# EAGLE design pi-hrf (EAGLE 7.5.0)
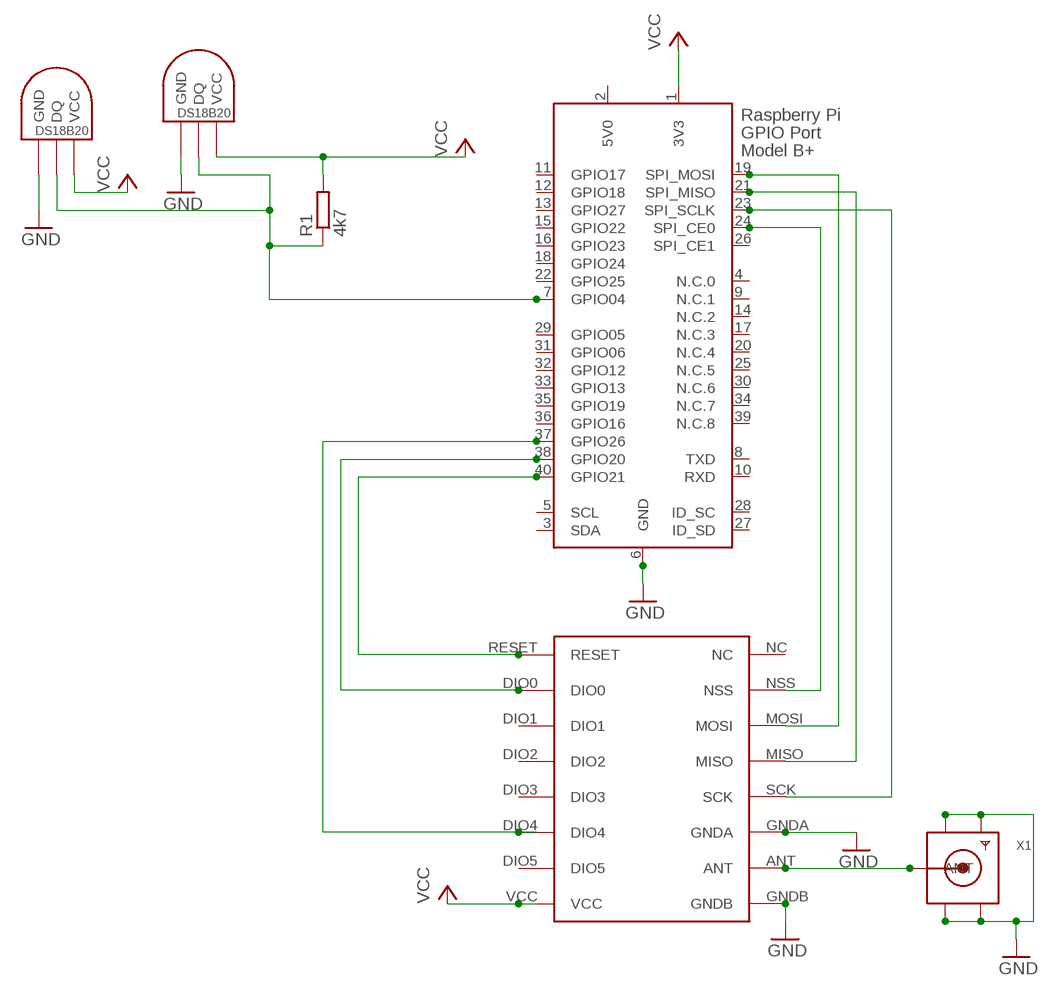
[diagram p0: schematic, sheet 1]

## Parts
R1  4k7  R-EU_0207/10  [0207/10]
U1  RFM69HW  [RFM]
U$2  DS1820TO92  [DS1820]
U$3  DS1820TO92  [DS1820]
X1  SMACONNECTOR_EDGE  [SMA_EDGELAUNCH]
X2  RASPI_BOARD_B+_E3P  [RASPI_BOARD_B+_EDGES_3DRILL_PAD]

## Nets
GND: U1.GNDA U1.GNDB U$2.GND U$3.GND X1.GND@1(GND4) X1.GND@2(GND3) X1.GND@3(GND2) X1.GND@4(GND1) X2.6(GND)
N$1: U1.NSS X2.24(SPI_CE0)
N$2: U1.SCK X2.23(SPI_SCLK)
N$3: U1.MOSI X2.19(SPI_MOSI)
N$5: R1.1 U$2.DQ U$3.DQ X2.7(GPIO04)
N$6: U1.ANT X1.P(ANT)
N$7: U1.RESET X2.40(GPIO21)
N$8: U1.DIO0 X2.38(GPIO20)
N$9: U1.DIO4 X2.37(GPIO26)
N$10: U1.MISO X2.21(SPI_MISO)
VCC: R1.2 U1.VCC U$2.VDD(VCC) U$3.VDD(VCC) X2.1(3V3)
Unconnected: U1.DIO1 U1.DIO2 U1.DIO3 U1.DIO5 U1.NC X2.3(SDA) X2.4(N.C.0) X2.5(SCL) X2.8(TXD) X2.9(N.C.1) X2.10(RXD) X2.11(GPIO17) X2.12(GPIO18) X2.13(GPIO27) X2.14(N.C.2) X2.15(GPIO22) X2.16(GPIO23) X2.17(N.C.3) X2.18(GPIO24) X2.20(N.C.4) X2.22(GPIO25) X2.25(N.C.5) X2.26(SPI_CE1) X2.27(ID_SD) X2.28(ID_SC) X2.29(GPIO05) X2.30(N.C.6) X2.31(GPIO06) X2.32(GPIO12) X2.33(GPIO13) X2.34(N.C.7) X2.35(GPIO19) X2.36(GPIO16) X2.39(N.C.8)

## Power pins joined to a net without a drawn wire
5V0: X2.2(5V0)

## Library data of the parts
R1 = rcl:R-EU_: RESISTOR, European symbol
U1 = hopeRF2:RFM69HW
U$2 U$3 = Ava:DS1820: DS18B20 Programmable Resolution 1-Wire Digital Thermometer Description The DS18B20 digital thermometer provides 9-bit to 12-bit Celsius temperature measurements and has an alarm function with nonvolatile user-programmable upper and lower trigger points. The DS18B20 communicates over a 1-Wire® bus that by definition requires only one data line (and ground) for communication with a central microprocessor. It has an operating temperature range of -55°C to +125°C and is accurate to ±0.5°C over the range of -10°C to +85°C. In addition, the DS18B20 can derive power directly from the data line ("parasite power"), eliminating the need for an external power supply. Each DS18B20 has a unique 64-bit serial code, which allows multiple DS18B20s to function on the same 1-Wire bus. Thus, it is simple to use one microprocessor to control many DS18B20s distributed over a large area. Applications that can benefit from this feature include HVAC environmental controls, temperature monitoring systems inside buildings, equipment, or machinery, and process monitoring and control systems.
X1 = adafruit:SMACONNECTOR: SMA Connector 90° DIP SMA Connector, 50 Ohm (4UConnector: 07259)
X2 = raspberrypi_bastelstube_v13:RASPI_BOARD_B+: Raspberry Pi GPIO connector with markings for the outer dimensions of the Raspberry Pi board model B+ with different sets of drill holes or mounting pads

## Board
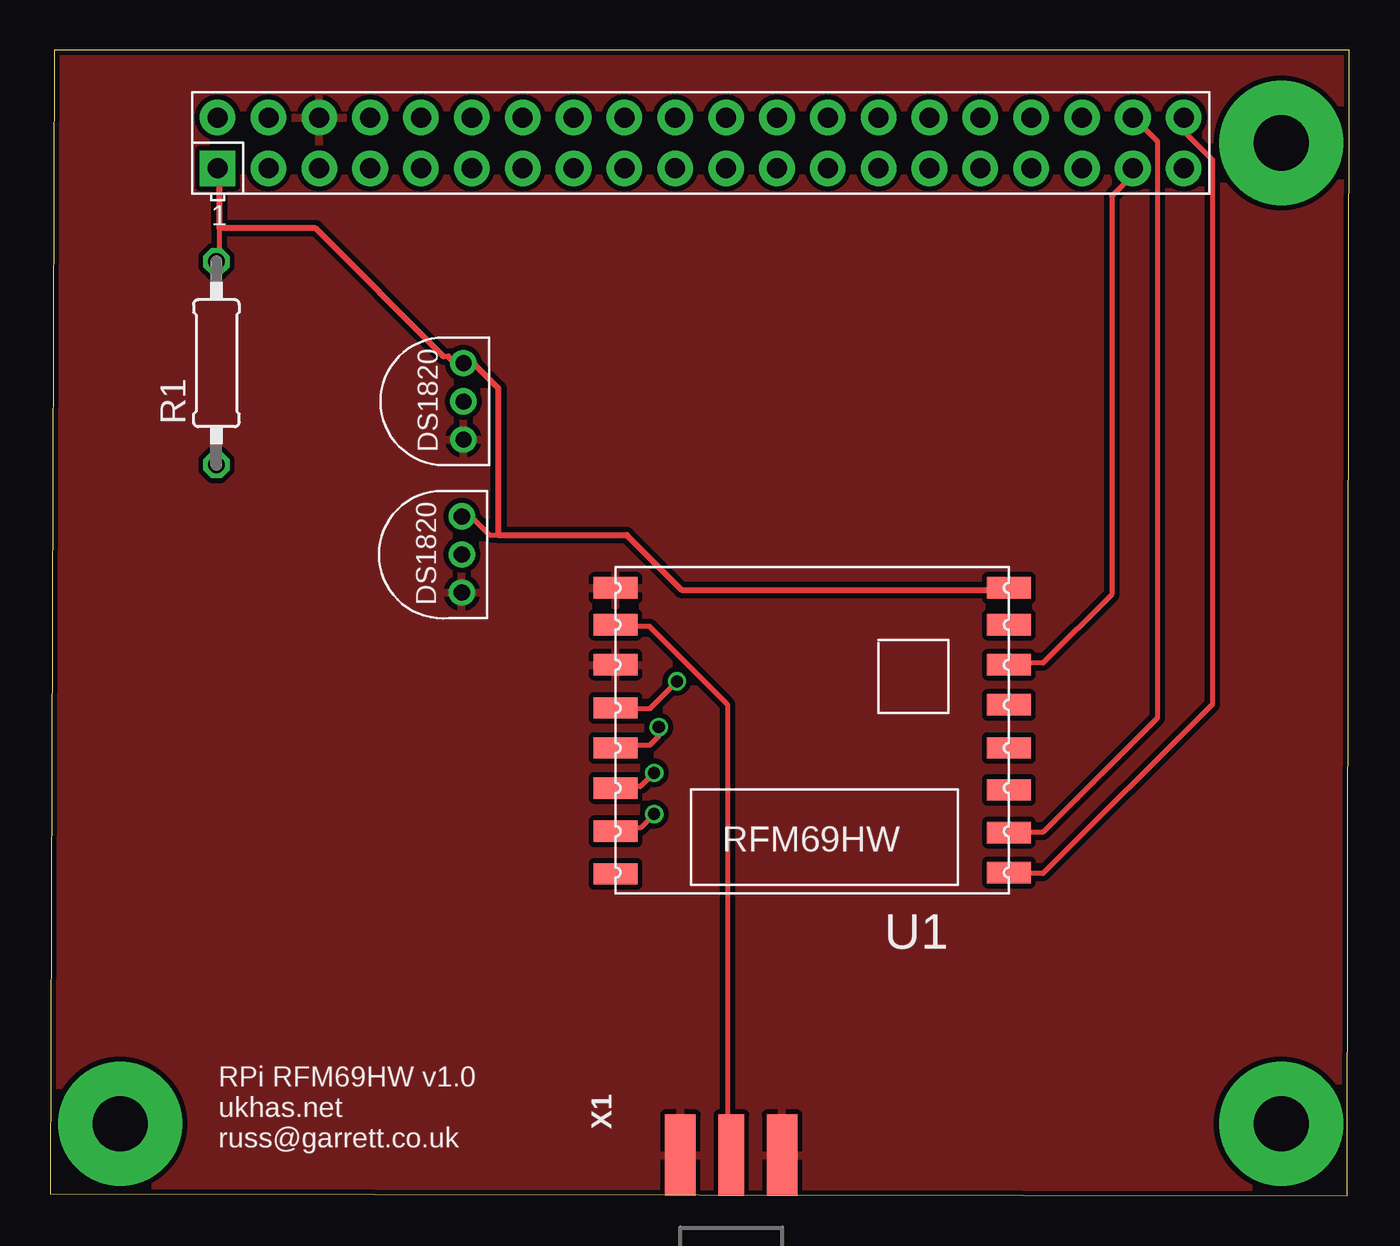
[diagram p1: board, top side]
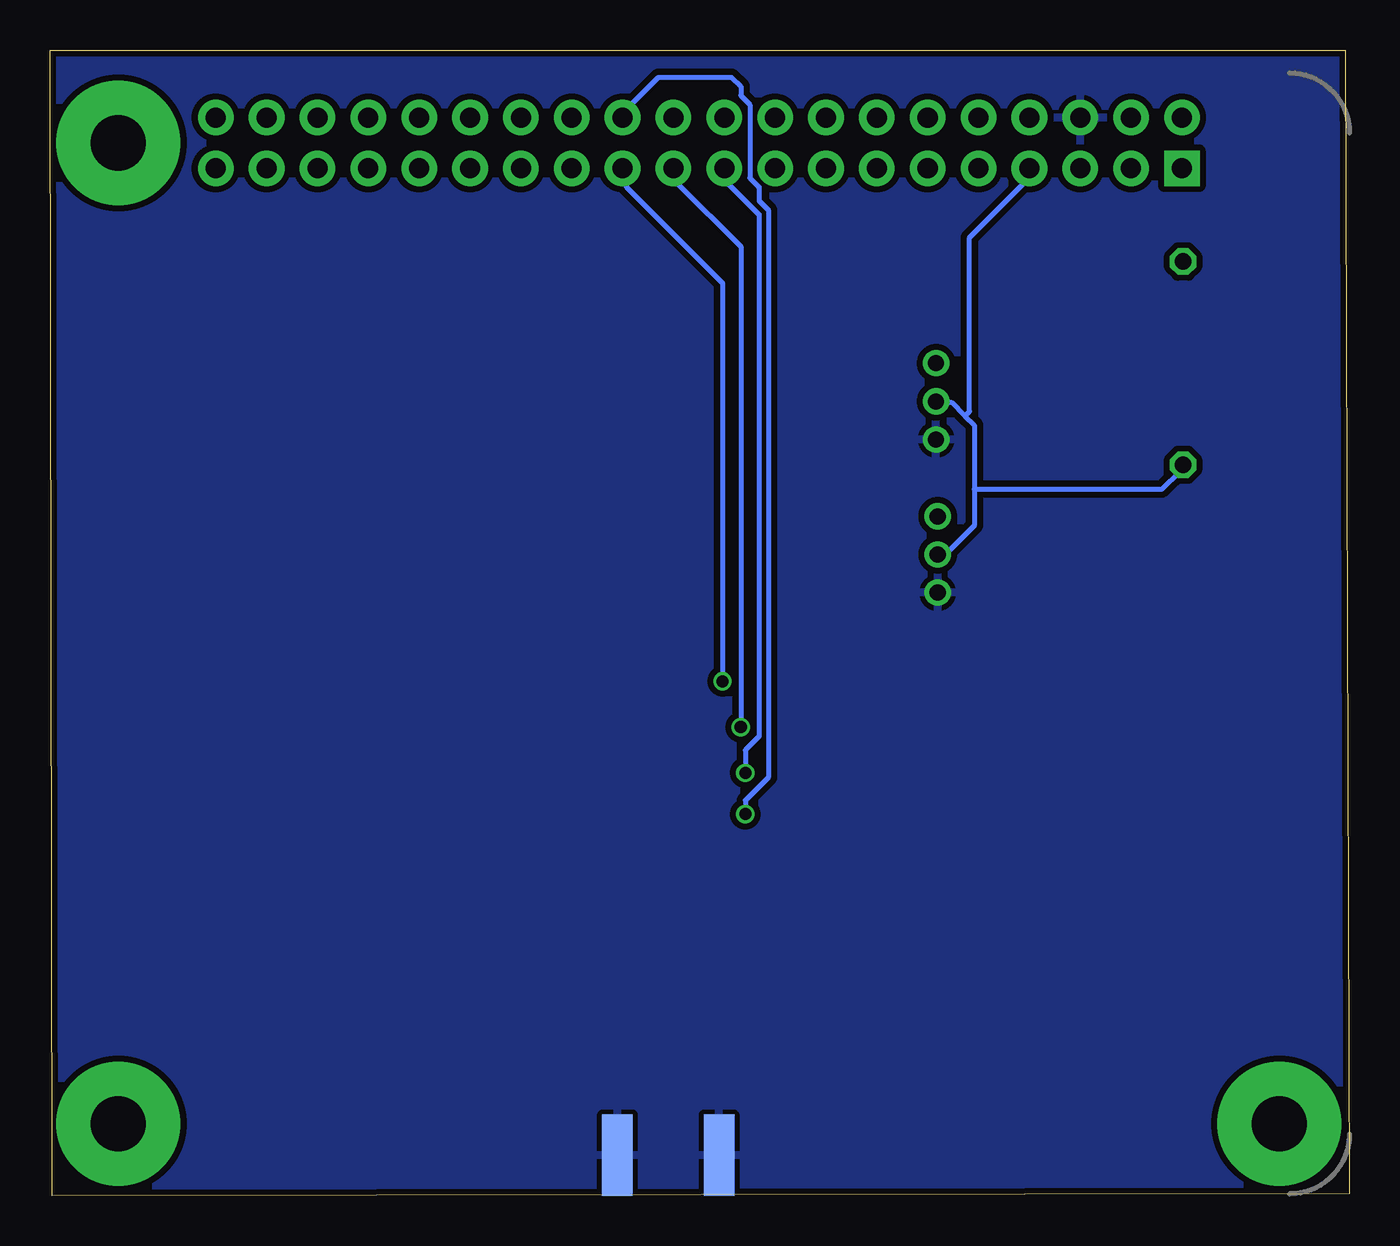
[diagram p2: board, bottom side, seen from below]

Size 64.91 x 57.24 mm. Coordinates in mm from the lower left corner, seen from the top.
Outline: 0,0.1 64.81,0 64.91,57.24 0.2,57.24 0,0.1
Copper layers (1*16): Top 0.035mm / dielectric 1.5mm / Bottom 0.035mm
Design rules "dirt_cheap_dirty_boards.v1": minimum track width 5mil, minimum drill 12mil, track to track 5mil, track to pad 5mil, pad to pad 5mil, via to via 5mil, smd to smd 0mil, copper to edge 10mil, drill to drill 10mil, minimum pad ring 10mil, minimum via ring 6mil, stop-mask expansion 2mil, vias tented up to drill 25mil, thermal gap 10mil

### Footprints (pad centres in the part's own frame; a part is rotated, then mirrored left to right if it is on the bottom)
0207/10 = drill 0.813 octagon: 1 -5.08,0; 2 5.08,0
RFM = smd 2.184 x 1.067: ANT 19.651,2.889; DIO0 0,13.27; DIO1 0,11.143; DIO2 0,9.047; DIO3 0,6.889; DIO4 0,4.889; DIO5 0,2.889; GNDA 19.651,4.889; GNDB 19.651,1.048; MISO 19.651,9.047; MOSI 19.651,11.047; NC 19.651,15.334; NSS 19.651,13.206; RESET 0,15.27; SCK 19.651,7.048; VCC 0,1.048
DS1820 = drill 0.8: DQ 2.54,-1.27; GND 0.635,-1.27; VDD 4.445,-1.27
SMA_EDGELAUNCH = smd 4.064 x 1.524: GND@1 2.032,-2.54; GND@2 2.032,2.54 | smd 4.064 x 1.524 bottom: GND@3 2.032,2.54; GND@4 2.032,-2.54 | smd 4.064 x 1.27: P 2.032,0
RASPI_BOARD_B+_EDGES_3DRILL_PAD = drill 1 pad 1.778 square: 1 8.37,51.23 | drill 1 pad 1.778: 2 8.37,53.77; 3 10.91,51.23; 4 10.91,53.77; 5 13.45,51.23; 6 13.45,53.77; 7 15.99,51.23; 8 15.99,53.77; 9 18.53,51.23; 10 18.53,53.77; 11 21.07,51.23; 12 21.07,53.77; 13 23.61,51.23; 14 23.61,53.77; 15 26.15,51.23; 16 26.15,53.77; 17 28.69,51.23; 18 28.69,53.77; 19 31.23,51.23; 20 31.23,53.77; 21 33.77,51.23; 22 33.77,53.77; 23 36.31,51.23; 24 36.31,53.77; 25 38.85,51.23; 26 38.85,53.77; 27 41.39,51.23; 28 41.39,53.77; 29 43.93,51.23; 30 43.93,53.77; 31 46.47,51.23; 32 46.47,53.77; 33 49.01,51.23; 34 49.01,53.77; 35 51.55,51.23; 36 51.55,53.77; 37 54.09,51.23; 38 54.09,53.77; 39 56.63,51.23; 40 56.63,53.77 | drill 2.75 pad 6.2: 41 3.5,3.5; 42 61.5,3.5; 43 61.5,52.5

### Placement (x,y rotation side)
R1  8.31,41.6 90 top
U1  47.9,31.42 180 top
U$2  19.3,29.5 90 top
U$3  19.38,37.15 90 top
X1  34.03,0 90 top
X2  0,0.1 0 top

### Tracks (layer width: path | path; a pad name or v marks a point on that pad's centre or on a via)
GND
  Bottom 0.254: 31,2.1 X1.GND@2
  pour Top (isolate 0.254): 0,57.15 0,0.1 66.04,0.1 65.94,57.25
  pour Bottom (isolate 0.305): 0,57.3 66,57.2 66.1,0.1 0,0.1
N$1  (via drill 0.61)
  Top 0.254: v30.18,19.07 29.49,18.39 28.35,18.39 U1.NSS
  Bottom 0.254: v30.18,19.07 30.18,19.76 29.03,20.9 29.03,49.25 29.49,49.71 29.49,50.39 29.95,50.85 29.95,54.51 30.4,54.96 30.4,55.42 30.86,55.88 34.52,55.88 36.35,54.05 X2.24
N$2  (via drill 0.61)
  Top 0.254: v31.32,25.7 29.95,24.33 28.35,24.33 U1.SCK
  Bottom 0.254: v31.32,25.7 31.32,45.59 36.12,50.39 36.12,51.31 X2.23
N$3  (via drill 0.61)
  Top 0.254: v30.18,21.13 29.49,20.45 28.35,20.45 U1.MOSI
  Bottom 0.254: v30.18,21.13 30.18,22.27 29.49,22.96 29.49,49.02 31.09,50.62 31.09,51.31 X2.19
N$5
  Bottom 0.254: 16,51.1 X2.7 16,51.08 16,50.85 18.97,47.88 18.97,39.19 19.2,38.96 | 18.75,35.3 18.75,38.51 19.2,38.96 | 18.75,35.3 18.75,33.48 20.12,32.1 20.34,32.1 U$2.DQ | 19.2,38.96 19.89,39.65 20.57,39.65 U$3.DQ | 18.75,35.3 9.37,35.3 8.46,36.22 8.46,36.45 R1.1
N$6
  Top 0.254: U1.ANT 28.35,28.45 29.95,28.45 33.83,24.56 33.83,2.16 X1.P
N$7
  Top 0.254: U1.RESET 48.01,16.1 49.61,16.1 58.06,24.56 58.06,51.76 56.69,53.13 56.69,53.82 X2.40
N$8
  Top 0.254: U1.DIO0 48.01,18.16 49.61,18.16 55.32,23.87 55.32,52.68 54.18,53.82 X2.38
N$9
  Top 0.254: U1.DIO4 48.01,26.62 49.61,26.62 53.03,30.05 53.03,49.94 53.95,50.85 53.95,51.31 X2.37
N$10  (via drill 0.61)
  Top 0.254: v30.4,23.42 30.4,22.96 29.95,22.5 28.35,22.5 U1.MISO
  Bottom 0.254: v30.4,23.42 30.4,47.42 33.6,50.62 33.6,51.31 X2.21
VCC
  Top 0.254: 8.46,48.34 8.46,46.73 R1.2 | 8.46,51.31 X2.1 | 22.4,33.02 21.95,33.02 21.03,33.93 U$2.VDD | 47.78,30.28 U1.VCC | 21.26,41.48 20.8,41.48 U$3.VDD 20.57,41.7 | 19.89,41.93 19.66,41.93
  Top 0.305: 8.46,51.31 8.46,48.34 13.26,48.34 19.66,41.93 | 47.78,30.28 31.55,30.28 28.8,33.02 22.4,33.02 22.4,40.33 21.26,41.48 | 19.89,41.93 20.12,41.7 20.57,41.7
  Bottom 0.254: 8.5,51.1 X2.1

### Text on the board
tNames: RPi RFM69HW v1.0 / ukhas.net / russ@garrett.co.uk